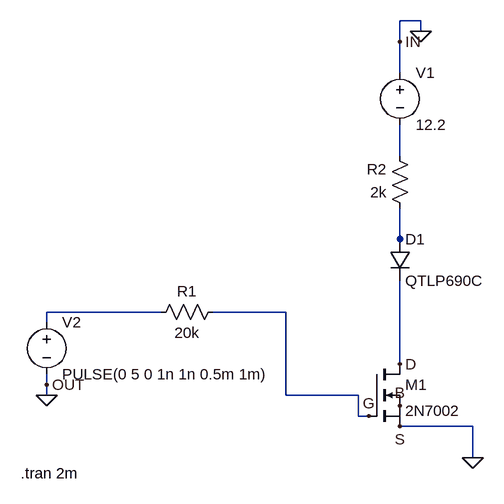
[diagram p0: schematic tranzystor_mos.asc]
tranzystor_mos.asc, the LTspice schematic file:
Version 4.1
SHEET 1 1092 680
WIRE 528 -176 496 -176
WIRE 528 -160 528 -176
WIRE 496 -144 496 -176
WIRE 496 -96 496 -144
WIRE 496 32 496 -16
WIRE 496 160 496 112
WIRE 496 176 496 160
WIRE 128 272 -48 272
WIRE 320 272 208 272
WIRE -48 288 -48 272
WIRE 496 352 496 224
WIRE -48 384 -48 368
WIRE -48 400 -48 384
WIRE 320 400 320 272
WIRE 432 400 320 400
WIRE 432 432 432 400
WIRE 448 432 432 432
WIRE 608 448 496 448
WIRE 608 496 608 448
FLAG 528 -160 0
FLAG 608 496 0
FLAG -48 400 0
FLAG 496 -144 IN
FLAG -48 384 OUT
FLAG 496 352 D
FLAG 496 448 S
FLAG 448 432 G
FLAG 496 416 B
SYMBOL diode 480 160 R0
SYMATTR InstName D1
SYMATTR Value QTLP690C
SYMBOL voltage 496 -112 R0
WINDOW 123 0 0 Left 0
WINDOW 39 0 0 Left 0
SYMATTR InstName V1
SYMATTR Value 12.2
SYMBOL res 224 256 R90
WINDOW 0 0 56 VBottom 2
WINDOW 3 32 56 VTop 2
SYMATTR InstName R1
SYMATTR Value 20k
SYMBOL res 512 128 R180
WINDOW 0 36 76 Left 2
WINDOW 3 36 40 Left 2
SYMATTR InstName R2
SYMATTR Value 2k
SYMBOL voltage -48 272 R0
WINDOW 123 0 0 Left 0
WINDOW 39 0 0 Left 0
SYMATTR InstName V2
SYMATTR Value PULSE(0 5 0 1n 1n 0.5m 1m)
SYMBOL nmos 448 352 R0
SYMATTR InstName M1
SYMATTR Value 2N7002
TEXT -88 520 Left 2 !.tran 2m

The netlist it stands for:
* tranzystor_mos.asc
D1 N002 D QTLP690C
V1 0 N001 12.2
R1 G N003 20k
R2 N002 N001 2k
V2 N003 0 PULSE(0 5 0 1n 1n 0.5m 1m)
M1 D G 0 0 2N7002
.model D D
.lib standard.dio
.model NMOS NMOS
.model PMOS PMOS
.lib standard.mos
.tran 2m
.backanno
.end